# Altium schematic sheet IMX7S_POWER.SchDoc: IMX7S_Design (part 1 of 2)
size A3; Date: 26/07/2019; CheckedBy: Aloïs MICLO; Author: Aloïs MICLO; CompanyName: Bordeaux Ynov Campus; DrawnBy: Aloïs MICLO; Engineer: Aloïs MICLO; Revision: 1.0; SheetNumber: 1; SheetTotal: 8; ImagePath: C:\Users\alois\OneDrive\Documents\YNOV\99_DIVERS\YNOV_CAMPUS.png
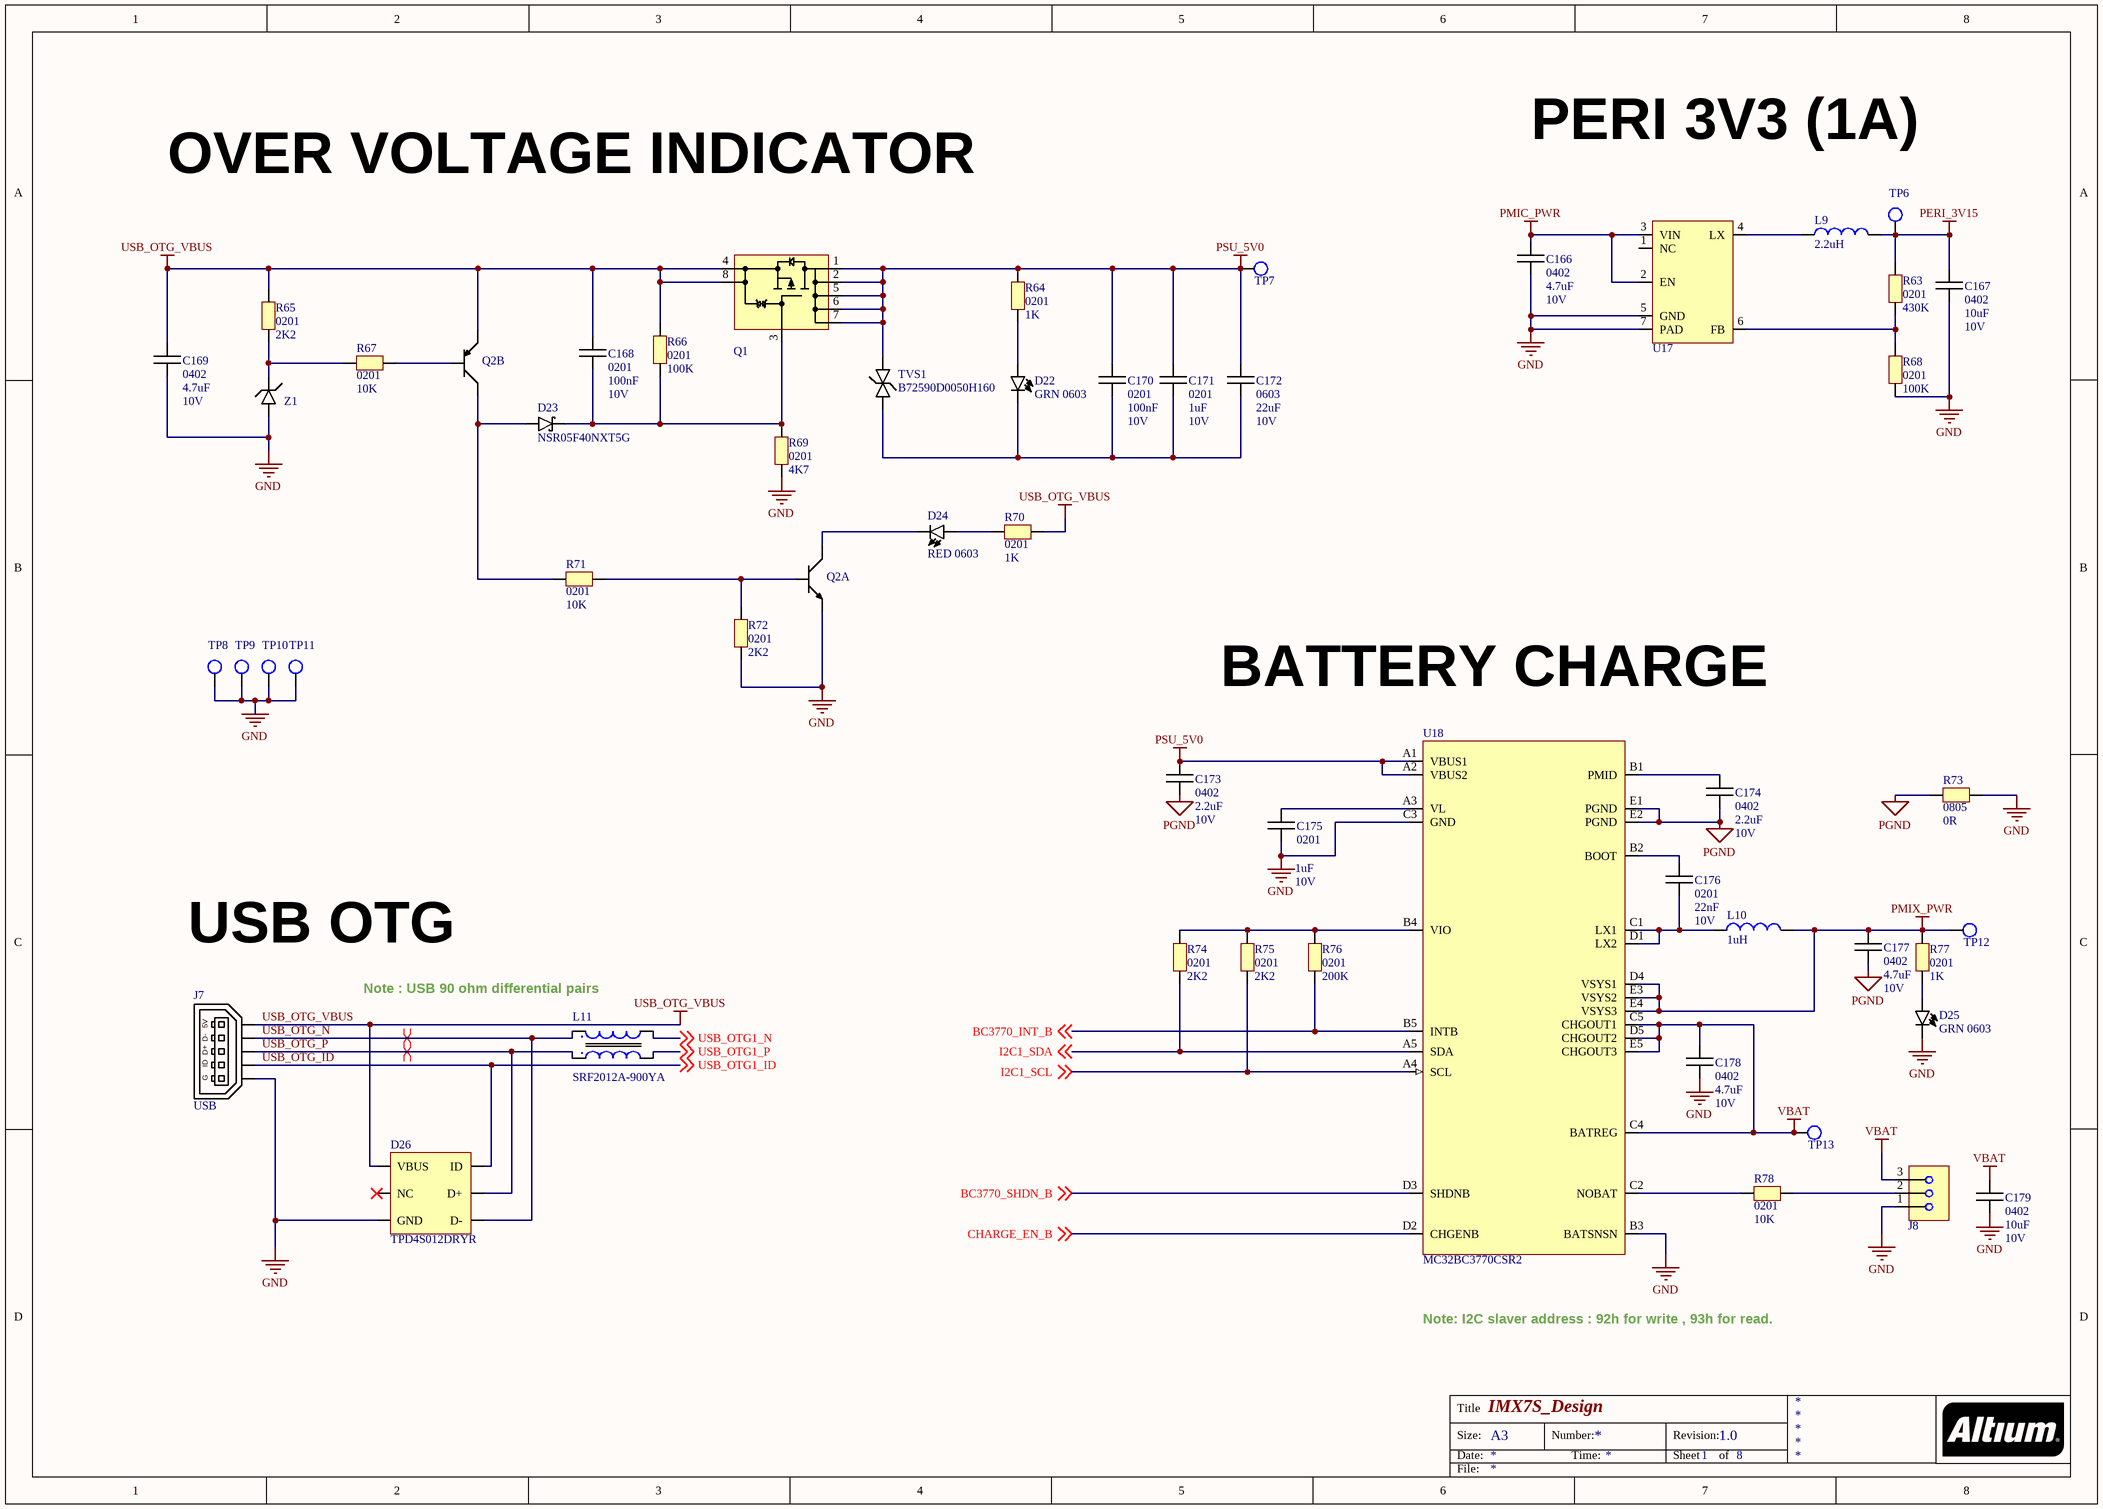
[diagram p0: IMX7S_POWER.SchDoc]

## Parts
C166  value 4.7uF  PACKAGE: 0402  VOLTAGE: 10V  [C0402]  (hidden comment: C0402)
C167  value 10uF  PACKAGE: 0402  VOLTAGE: 10V  [C0402]  (hidden comment: C0402)
C168  value 100nF  PACKAGE: 0201  VOLTAGE: 10V  [C0201]  (hidden comment: C0201)
C169  value 4.7uF  PACKAGE: 0402  VOLTAGE: 10V  [C0402]  (hidden comment: C0402)
C170  value 100nF  PACKAGE: 0201  VOLTAGE: 10V  [C0201]  (hidden comment: C0201)
C171  value 1uF  PACKAGE: 0201  VOLTAGE: 10V  [C0201]  (hidden comment: C0201)
C172  value 22uF  PACKAGE: 0603  VOLTAGE: 10V  [C0603]  (hidden comment: C0603)
C173  value 2.2uF  PACKAGE: 0402  VOLTAGE: 10V  [C0402]  (hidden comment: C0402)
C174  value 2.2uF  PACKAGE: 0402  VOLTAGE: 10V  [C0402]  (hidden comment: C0402)
C175  value 1uF  PACKAGE: 0201  VOLTAGE: 10V  [C0201]  (hidden comment: C0201)
C176  value 22nF  PACKAGE: 0201  VOLTAGE: 10V  [C0201]  (hidden comment: C0201)
C177  value 4.7uF  PACKAGE: 0402  VOLTAGE: 10V  [C0402]  (hidden comment: C0402)
C178  value 4.7uF  PACKAGE: 0402  VOLTAGE: 10V  [C0402]  (hidden comment: C0402)
C179  value 10uF  PACKAGE: 0402  VOLTAGE: 10V  [C0402]  (hidden comment: C0402)
D22  GRN 0603  [D0603]
D23  NSR05F40NXT5G  [DSN2]
D24  RED 0603  [D0603]
D25  GRN 0603  [D0603]
D26  TPD4S012DRYR  [SON6]
J7  USB  [MICRO_USB]
J8  JST_XH_3  [JST-XH]  (value not drawn)
L9  value 2.2uH  [SELF]  (hidden comment: Self)
L10  value 1uH  [R0402]  (hidden comment: Self)
L11  SRF2012A-900YA  [EMI_SP]
Q1  FDMA530PZ  [MICROFET_2x2]  (value not drawn)
Q2  HBDM60V600W-7  [SOT363]  (value not drawn)  (parts A,B of 2)
R63  value 430K  PACKAGE: 0201  [R0201]  (hidden comment: R0201)
R64  value 1K  PACKAGE: 0201  [R0201]  (hidden comment: R0201)
R65  value 2K2  PACKAGE: 0201  [R0201]  (hidden comment: R0201)
R66  value 100K  PACKAGE: 0201  [R0201]  (hidden comment: R0201)
R67  value 10K  PACKAGE: 0201  [R0201]  (hidden comment: R0201)
R68  value 100K  PACKAGE: 0201  [R0201]  (hidden comment: R0201)
R69  value 4K7  PACKAGE: 0201  [R0201]  (hidden comment: R0201)
R70  value 1K  PACKAGE: 0201  [R0201]  (hidden comment: R0201)
R71  value 10K  PACKAGE: 0201  [R0201]  (hidden comment: R0201)
R72  value 2K2  PACKAGE: 0201  [R0201]  (hidden comment: R0201)
R73  value 0R  PACKAGE: 0805  [R0805]  (hidden comment: R0805)
R74  value 2K2  PACKAGE: 0201  [R0201]  (hidden comment: R0201)
R75  value 2K2  PACKAGE: 0201  [R0201]  (hidden comment: R0201)
R76  value 200K  PACKAGE: 0201  [R0201]  (hidden comment: R0201)
R77  value 1K  PACKAGE: 0201  [R0201]  (hidden comment: R0201)
R78  value 10K  PACKAGE: 0201  [R0201]  (hidden comment: R0201)
TP6  TestPoint  [TESTPOINT]  (value not drawn)
TP7  TestPoint  [TESTPOINT]  (value not drawn)
TP8  TestPoint  [TESTPOINT]  (value not drawn)
TP9  TestPoint  [TESTPOINT]  (value not drawn)
TP10  TestPoint  [TESTPOINT]  (value not drawn)
TP11  TestPoint  [TESTPOINT]  (value not drawn)
TP12  TestPoint  [TESTPOINT]  (value not drawn)
TP13  TestPoint  [TESTPOINT]  (value not drawn)
TVS1  B72590D0050H160  [R0402]
U17  AP3417CDNTR-G1  [DFN2020]  (value not drawn)
U18  MC32BC3770CSR2  [BGA25x5]
Z1  Zener  [Zener]  (value not drawn)

## Nets
GND: C166.2 C167.2 C169.1 C175.1 C178.2 C179.2 D25.2(K) D26.4(GND) J7.5(GND) J8.1 Q2.5(EQ1) R68.1 R69.2 R72.1 R73.2 TP8.1 TP9.1 TP10.1 TP11.1 U17.5(GND) U17.7(PAD) U18.B3(BATSNSN) U18.C3(GND) Z1.1(A)
PERI_3V15: C167.1 L9.2 R63.2 TP6.1
PGND: C173.1 C174.1 C177.2 R73.1 U18.E1(PGND) U18.E2(PGND)
PMIC_PWR: C166.1 U17.2(EN) U17.3(VIN)
PMIX_PWR: C177.1 L10.2 R77.2 TP12.1 U18.D4(VSYS1) U18.E3(VSYS2) U18.E4(VSYS3)
PSU_5V0: C170.2 C171.2 C172.2 C173.2 Q1.1 Q1.2 Q1.5 Q1.6 Q1.7 R64.2 TP7.1 TVS1.2 U18.A1(VBUS1) U18.A2(VBUS2)
USB_OTG_VBUS: C168.2 C169.2 D26.6(VBUS) J7.1(5V) Q1.4 Q1.8 Q2.4(EQ2) R65.2 R66.1 R70.2
VBAT: C178.1 C179.1 J8.3 TP13.1 U18.C4(BATREG) U18.C5(CHGOUT1) U18.D5(CHGOUT2) U18.E5(CHGOUT3)
BC3770_INT_B: R76.1 U18.B5(INTB) ; off-sheet BC3770_INT_B
BC3770_SHDN_B: U18.D3(SHDNB) ; off-sheet BC3770_SHDN_B
CHARGE_EN_B: U18.D2(CHGENB) ; off-sheet CHARGE_EN_B
I2C1_SCL: R75.1 U18.A4(SCL) ; off-sheet I2C1_SCL
I2C1_SDA: R74.1 U18.A5(SDA) ; off-sheet I2C1_SDA
USB_OTG1_N: L11.2 ; off-sheet USB_OTG1_N
USB_OTG1_P: L11.3 ; off-sheet USB_OTG1_P
USB_OTG_ID: D26.3(ID) J7.4(ID) ; off-sheet USB_OTG1_ID  [also labelled USB_OTG1_ID]
USB_OTG_N: D26.2(D-) J7.2(D-) L11.1
USB_OTG_P: D26.1(D+) J7.3(D+) L11.4
NetC168_1: C168.1 D23.1(K) Q1.3 R66.2 R69.1
NetC170_1: C170.1 C171.1 C172.1 D22.2(K) TVS1.1
NetC174_2: C174.2 U18.B1(PMID)
NetC175_2: C175.2 U18.A3(VL)
NetC176_1: C176.1 L10.1 U18.C1(LX1) U18.D1(LX2)
NetC176_2: C176.2 U18.B2(BOOT)
NetD22_1: D22.1(A) R64.1
NetD23_2: D23.2(A) Q2.3(CQ2) R71.2
NetD24_1: D24.1(A) R70.1
NetD24_2: D24.2(K) Q2.6(CQ1)
NetD25_1: D25.1(A) R77.1
NetJ8_2: J8.2 R78.1
NetL9_1: L9.1 U17.4(LX)
NetQ2_1: Q2.1(QB1) R71.1 R72.2
NetQ2_2: Q2.2(QB2) R67.1
NetR63_1: R63.1 R68.2 U17.6(FB)
NetR65_1: R65.1 R67.2 Z1.2(K)
NetR74_2: R74.2 R75.2 R76.2 U18.B4(VIO)
NetR78_2: R78.2 U18.C2(NOBAT)

Not connected (* = marked no-connect by the designer): D26 5(NC)*; U17 1(NC)

## Layout directives
differential pair: USB_OTG_N, USB_OTG_P

## Notes on the sheet
- OVER VOLTAGE INDICATOR
- PERI 3V3 (1A)
- BATTERY CHARGE
- USB OTG
- (near L11) Note : USB 90 ohm differential pairs
- Note: I2C slaver address : 92h for write , 93h for read.
- Title
- Size:
- Date:
- A3
- Number:
- Time:
- Revision:
- Sheet
- of
- File:
- (in symbol MICRO_USB) G